# Altium project Sensorless_BLDC_Controller.PrjPcb
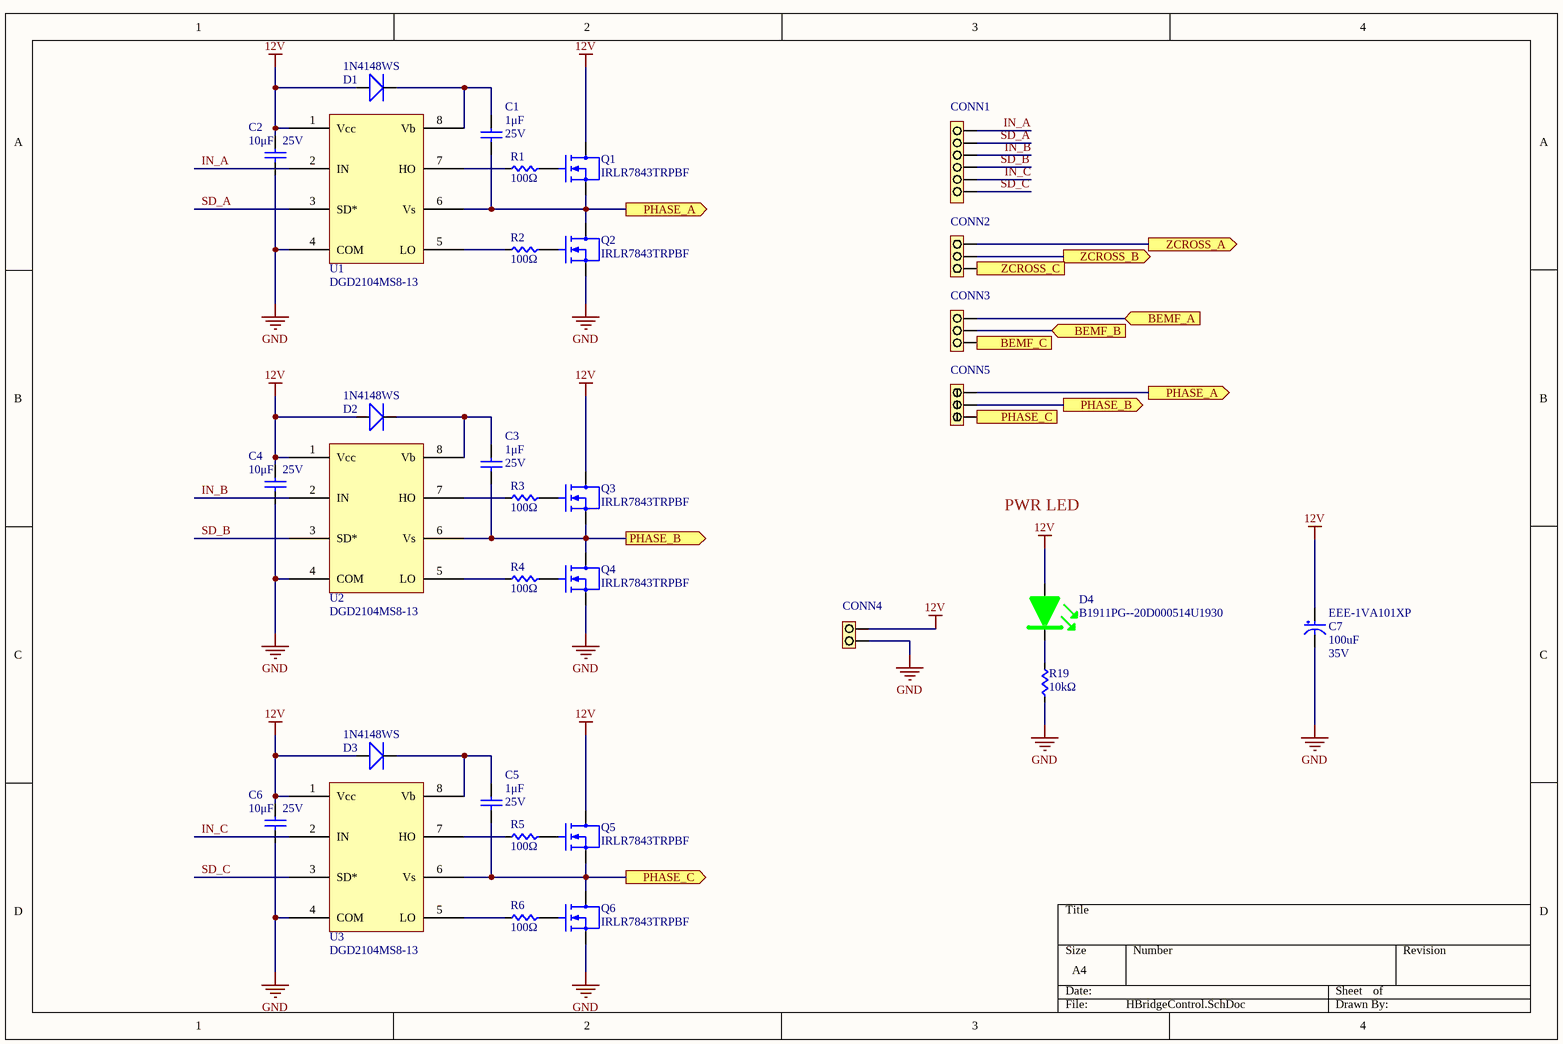
[diagram p0: HBridgeControl.SchDoc]
Engineer: Aryan Kashem; Goal: Sensorless BLDC controller using Back EMF and 6 axis commutation
2 sheets, 49 parts. Net scope: flat (ports and power ports of the same name join across sheets).
Board file: Sensorless_BLDC_PCB.PcbDoc
Sheets:
  HBridgeControl.SchDoc
  ZeroCrossDetection.SchDoc

## Sheet HBridgeControl.SchDoc: Sensorless BLDC interface
size A4; DocumentNumber: 1; Revision: 2; SheetNumber: 1; SheetTotal: 2

### Parts
C1  value 1μF  Voltage Rating: 25V  [CAP0603]  (hidden comment: GCM188R71E105KA64D)
C2  value 10μF  Voltage Rating: 25V  [CAP0603]  (hidden comment: GRM188R61E106MA73J)
C3  value 1μF  Voltage Rating: 25V  [CAP0603]  (hidden comment: GCM188R71E105KA64D)
C4  value 10μF  Voltage Rating: 25V  [CAP0603]  (hidden comment: GRM188R61E106MA73J)
C5  value 1μF  Voltage Rating: 25V  [CAP0603]  (hidden comment: GCM188R71E105KA64D)
C6  value 10μF  Voltage Rating: 25V  [CAP0603]  (hidden comment: GRM188R61E106MA73J)
C7  EEE-1VA101XP  Capacitance: 100uF  Voltage Rating: 35V  [SMD]
CONN1  MALE6PINCONN  [6POS HEADER]  (value not drawn)
CONN2  MALE3PINCONN  [3POS HEADER]  (value not drawn)
CONN3  MALE3PINCONN  [3POS HEADER]  (value not drawn)
CONN4  MALE2PINCONN  [2POS HEADER]  (value not drawn)
CONN5  SCREW3PINCONN  [SCREW3POSCONN]  (value not drawn)
D1  1N4148WS  [SOD_323]
D2  1N4148WS  [SOD_323]
D3  1N4148WS  [SOD_323]
D4  B1911PG--20D000514U1930  [LED0603]
Q1  IRLR7843TRPBF  [TO-252AA (DPAK)]
Q2  IRLR7843TRPBF  [TO-252AA (DPAK)]
Q3  IRLR7843TRPBF  [TO-252AA (DPAK)]
Q4  IRLR7843TRPBF  [TO-252AA (DPAK)]
Q5  IRLR7843TRPBF  [TO-252AA (DPAK)]
Q6  IRLR7843TRPBF  [TO-252AA (DPAK)]
R1  value 100Ω  [RES0603]  (hidden comment: RC0402JR-0710KL_1)
R2  value 100Ω  [RES0603]  (hidden comment: RC0402JR-0710KL_1)
R3  value 100Ω  [RES0603]  (hidden comment: RC0402JR-0710KL_1)
R4  value 100Ω  [RES0603]  (hidden comment: RC0402JR-0710KL_1)
R5  value 100Ω  [RES0603]  (hidden comment: RC0402JR-0710KL_1)
R6  value 100Ω  [RES0603]  (hidden comment: RC0402JR-0710KL_1)
R19  value 10kΩ  [RES0402]  (hidden comment: RC0402JR-0710KL)
U1  DGD2104MS8-13  [8SO]
U2  DGD2104MS8-13  [8SO]
U3  DGD2104MS8-13  [8SO]

### Ports
BEMF_A (in, see ZeroCrossDetection[2C]), BEMF_B (in, see ZeroCrossDetection[2C]), BEMF_C (in, see ZeroCrossDetection[2C]), PHASE_A (out, see HBridgeControl[2A], ZeroCrossDetection[1A]), PHASE_A (out, see HBridgeControl[3B], ZeroCrossDetection[1A]), PHASE_B (out, see HBridgeControl[2C], ZeroCrossDetection[1B]), PHASE_B (out, see HBridgeControl[3B], ZeroCrossDetection[1B]), PHASE_C (out, see HBridgeControl[2D], ZeroCrossDetection[1B]), PHASE_C (out, see HBridgeControl[3B], ZeroCrossDetection[1B]), ZCROSS_A (out, see ZeroCrossDetection[4A]), ZCROSS_B (out, see ZeroCrossDetection[4B]), ZCROSS_C (out, see ZeroCrossDetection[4B])

### Nets
12V: C2.1 C4.1 C6.1 C7.1 CONN4.1 D1.1 D2.1 D3.1 D4.1 Q1.2 Q3.2 Q5.2 U1.1(Vcc) U2.1(Vcc) U3.1(Vcc)
GND: C2.2 C4.2 C6.2 C7.2 CONN4.2 Q2.3 Q4.3 Q6.3 R19.2 U1.4(COM) U2.4(COM) U3.4(COM)
BEMF_A: CONN3.1 ; port BEMF_A
BEMF_B: CONN3.2 ; port BEMF_B
BEMF_C: CONN3.3 ; port BEMF_C
IN_A: CONN1.1 U1.2(IN)
IN_B: CONN1.3 U2.2(IN)
IN_C: CONN1.5 U3.2(IN)
SD_A: CONN1.2 U1.3(SD*)
SD_B: CONN1.4 U2.3(SD*)
SD_C: CONN1.6 U3.3(SD*)
NetC1_1: C1.1 D1.2 U1.8(Vb)
NetC1_2: C1.2 CONN5.1 Q1.3 Q2.2 U1.6(Vs) ; port PHASE_A
NetC3_1: C3.1 D2.2 U2.8(Vb)
NetC3_2: C3.2 CONN5.2 Q3.3 Q4.2 U2.6(Vs) ; port PHASE_B
NetC5_1: C5.1 D3.2 U3.8(Vb)
NetC5_2: C5.2 CONN5.3 Q5.3 Q6.2 U3.6(Vs) ; port PHASE_C
NetCONN2_1: CONN2.1 ; port ZCROSS_A
NetCONN2_2: CONN2.2 ; port ZCROSS_B
NetCONN2_3: CONN2.3 ; port ZCROSS_C
NetD4_2: D4.2 R19.1
NetQ1_1: Q1.1 R1.2
NetQ2_1: Q2.1 R2.2
NetQ3_1: Q3.1 R3.2
NetQ4_1: Q4.1 R4.2
NetQ5_1: Q5.1 R5.2
NetQ6_1: Q6.1 R6.2
NetR1_1: R1.1 U1.7(HO)
NetR2_1: R2.1 U1.5(LO)
NetR3_1: R3.1 U2.7(HO)
NetR4_1: R4.1 U2.5(LO)
NetR5_1: R5.1 U3.7(HO)
NetR6_1: R6.1 U3.5(LO)

### Notes on the sheet
- PWR LED

### Library data of the parts
C1 C3 C5 = GCM188R71E105KA64D: CAP CER 1UF 25V X7R 0603; Manufacturer 1: Murata; Manufacturer Part Number 1: GCM21BR71E105KA56L; Supplier 1: Digi-Key; Supplier Part Number 1: 490-4785-1-ND
C2 C4 C6 = GRM188R61E106MA73J: CAP CER 10UF 25V X5R 0603; Manufacturer 1: Murata; Manufacturer Part Number 1: GCM21BR71E105KA56L; Supplier 1: Digi-Key; Supplier Part Number 1: 490-4785-1-ND
C7 = EEE-1VA101XP: CAP ALUM 100UF 20% 35V SMD
D1-D3 = 1N4148WS: DIODE GEN PURP 75V 150MA SOD323F; Manufacturer: Onsemi; Manufacturer Part Number: 1N4148WS; Supplier: DigiKey; Supplier Part Number: 1N4148WSFSTR-ND
D4 = B1911PG--20D000514U1930: LED GREEN DIFFUSED 0603 SMD
Q1-Q6 = IRLR7843TRPBF: N-Channel 30 V 161A (Tc) 140W (Tc) Surface Mount TO-252AA (DPAK); Manufacturer: Infineon Technologies; Manufacturer Part Number: IRLR7843TRPBF; Supplier: DigiKey; Supplier Part Number: IIRLR7843PBFTR-ND
R1-R6 = RC0402JR-0710KL_1: RES 100 OHM 1% 1/10W 0603; Manufacturer 1: Stackpole Electronics Inc; Manufacturer Part Number 1: RNCP0603FTD10K0; Power Rating: 1/8W; Supplier Part Number 1: RNCP0603FTD10K0CT-ND; Supplier 1: Digi-Key
R19 = RC0402JR-0710KL: RES 10K OHM 5% 1/16W 0402; Manufacturer 1: Stackpole Electronics Inc; Manufacturer Part Number 1: RNCP0603FTD10K0; Power Rating: 1/8W; Supplier Part Number 1: RNCP0603FTD10K0CT-ND; Supplier 1: Digi-Key
U1-U3 = DGD2104MS8-13: IC GATE DRVR HALF-BRIDGE 8-SO; Manufacturer: Diodes Incorporated; Manufacturer Part Number: DGD2104MS8-13; Supplier: DigiKey; Supplier Part Number: DGD2104MS8-13DITR-ND

## Sheet ZeroCrossDetection.SchDoc
size A4; SheetNumber: 2; SheetTotal: 2
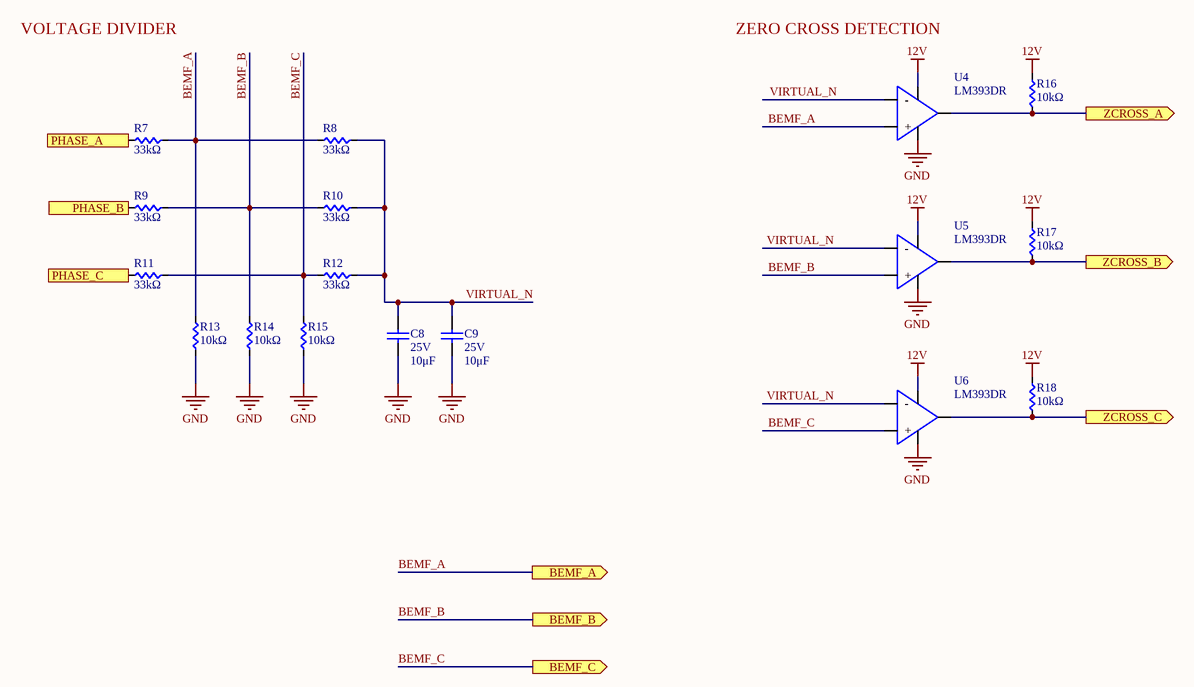
[diagram p1: ZeroCrossDetection.SchDoc]

### Parts
C8  value 10μF  Voltage Rating: 25V  [CAP0603]  (hidden comment: GRM188R61E106MA73J)
C9  value 10μF  Voltage Rating: 25V  [CAP0603]  (hidden comment: GRM188R61E106MA73J)
R7  value 33kΩ  [RES0603]  (hidden comment: RT0603BRD0733KL)
R8  value 33kΩ  [RES0603]  (hidden comment: RT0603BRD0733KL)
R9  value 33kΩ  [RES0603]  (hidden comment: RT0603BRD0733KL)
R10  value 33kΩ  [RES0603]  (hidden comment: RT0603BRD0733KL)
R11  value 33kΩ  [RES0603]  (hidden comment: RT0603BRD0733KL)
R12  value 33kΩ  [RES0603]  (hidden comment: RT0603BRD0733KL)
R13  value 10kΩ  [RES0402]  (hidden comment: RC0402JR-0710KL)
R14  value 10kΩ  [RES0402]  (hidden comment: RC0402JR-0710KL)
R15  value 10kΩ  [RES0402]  (hidden comment: RC0402JR-0710KL)
R16  value 10kΩ  [RES0402]  (hidden comment: RC0402JR-0710KL)
R17  value 10kΩ  [RES0402]  (hidden comment: RC0402JR-0710KL)
R18  value 10kΩ  [RES0402]  (hidden comment: RC0402JR-0710KL)
U4  LM393DR  [SOT25]
U5  LM393DR  [SOT25]
U6  LM393DR  [SOT25]

### Ports
BEMF_A (out, see HBridgeControl[4A]), BEMF_B (out, see HBridgeControl[4A]), BEMF_C (out, see HBridgeControl[4A]), PHASE_A (out, see HBridgeControl[2A], HBridgeControl[3B]), PHASE_B (out, see HBridgeControl[2C], HBridgeControl[3B]), PHASE_C (out, see HBridgeControl[2D], HBridgeControl[3B]), ZCROSS_A (out, see HBridgeControl[3B]), ZCROSS_B (out, see HBridgeControl[3B]), ZCROSS_C (out, see HBridgeControl[3B])

### Nets
12V: R16.2 R17.2 R18.2 U4.5(VCC) U5.5(VCC) U6.5(VCC)
GND: C8.2 C9.2 R13.2 R14.2 R15.2 U4.2(GND) U5.2(GND) U6.2(GND)
BEMF_A: R7.2 R8.1 R13.1 U4.3(+) ; port BEMF_A
BEMF_B: R9.2 R10.1 R14.1 U5.3(+) ; port BEMF_B
BEMF_C: R11.2 R12.1 R15.1 U6.3(+) ; port BEMF_C
VIRTUAL_N: C8.1 C9.1 R8.2 R10.2 R12.2 U4.1(-) U5.1(-) U6.1(-)
NetC1_2: R7.1 ; port PHASE_A
NetC3_2: R9.1 ; port PHASE_B
NetC5_2: R11.1 ; port PHASE_C
NetCONN2_1: R16.1 U4.4(VOUT) ; port ZCROSS_A
NetCONN2_2: R17.1 U5.4(VOUT) ; port ZCROSS_B
NetCONN2_3: R18.1 U6.4(VOUT) ; port ZCROSS_C

### Notes on the sheet
- VOLTAGE DIVIDER
- ZERO CROSS DETECTION

### Library data of the parts
C8 C9 = GRM188R61E106MA73J: as C2 on sheet HBridgeControl; Supplier 1: Digi-Key; Supplier Part Number 1: 490-4785-1-ND
R7-R12 = RT0603BRD0733KL: RES SMD 33K OHM 0.1% 1/10W 0603; Manufacturer 1: Stackpole Electronics Inc; Manufacturer Part Number 1: RNCP0603FTD10K0; Power Rating: 1/8W; Supplier Part Number 1: RNCP0603FTD10K0CT-ND; Supplier 1: Digi-Key
R13-R18 = RC0402JR-0710KL: as R19 on sheet HBridgeControl; Supplier Part Number 1: RNCP0603FTD10K0CT-ND; Supplier 1: Digi-Key
U4-U6 = LM393DR: Manufacturer: Texas Instruments; Manufacturer Part Number: LM393DR; Supplier: DigiKey; Supplier Part Number: 296-1015-2-ND

## Nets that join several sheets
12V: HBridgeControl (15 pins), ZeroCrossDetection (6 pins)
GND: HBridgeControl (12 pins), ZeroCrossDetection (8 pins)
BEMF_A: HBridgeControl (CONN3.1), ZeroCrossDetection (R7.2 R8.1 R13.1 U4.3)
BEMF_B: HBridgeControl (CONN3.2), ZeroCrossDetection (R9.2 R10.1 R14.1 U5.3)
BEMF_C: HBridgeControl (CONN3.3), ZeroCrossDetection (R11.2 R12.1 R15.1 U6.3)
NetC1_2: HBridgeControl (5 pins), ZeroCrossDetection (R7.1)
NetC3_2: HBridgeControl (5 pins), ZeroCrossDetection (R9.1)
NetC5_2: HBridgeControl (5 pins), ZeroCrossDetection (R11.1)
NetCONN2_1: HBridgeControl (CONN2.1), ZeroCrossDetection (R16.1 U4.4)
NetCONN2_2: HBridgeControl (CONN2.2), ZeroCrossDetection (R17.1 U5.4)
NetCONN2_3: HBridgeControl (CONN2.3), ZeroCrossDetection (R18.1 U6.4)